# EAGLE schematic avrpwm (EAGLE 6.6.0)
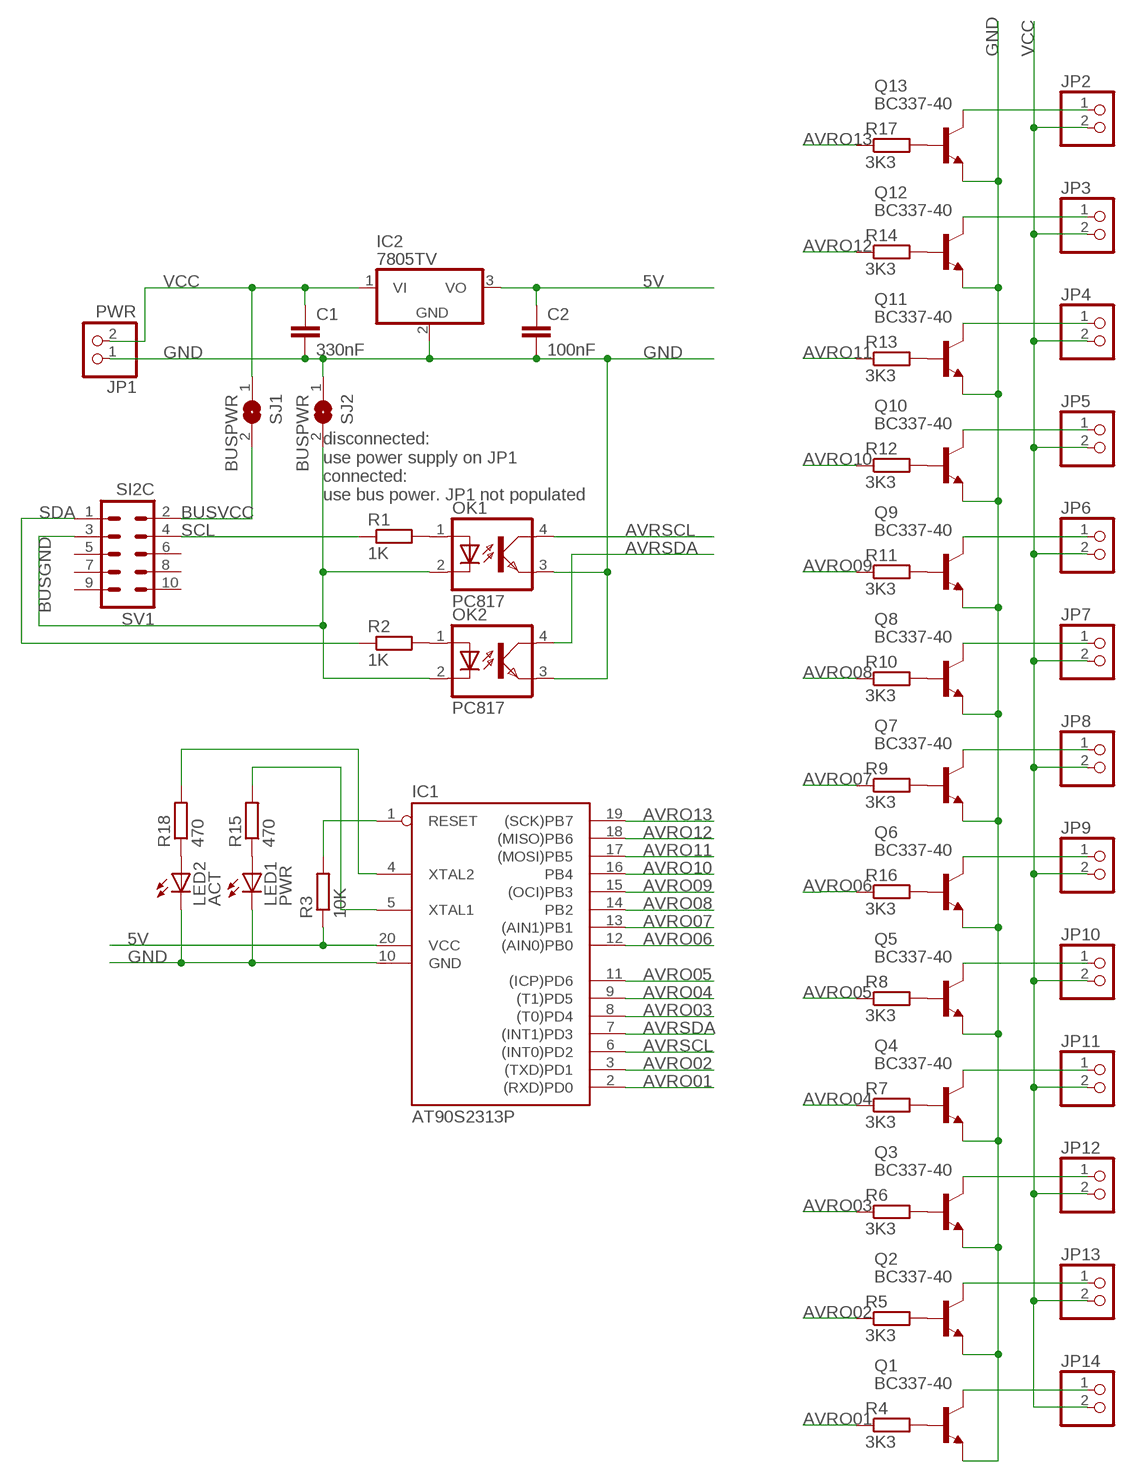
[diagram p0: schematic, sheet 1]

## Parts
C1  330nF  C2,5-3  [C2.5-3]
C2  100nF  C2,5-3  [C2.5-3]
IC1  AT90S2313P  [DIL20]
IC2  7805TV  [TO220V]
JP1  PWR  PINHD-1X2  [1X02]
JP2  PINHD-1X2  [1X02]
JP3  PINHD-1X2  [1X02]
JP4  PINHD-1X2  [1X02]
JP5  PINHD-1X2  [1X02]
JP6  PINHD-1X2  [1X02]
JP7  PINHD-1X2  [1X02]
JP8  PINHD-1X2  [1X02]
JP9  PINHD-1X2  [1X02]
JP10  PINHD-1X2  [1X02]
JP11  PINHD-1X2  [1X02]
JP12  PINHD-1X2  [1X02]
JP13  PINHD-1X2  [1X02]
JP14  PINHD-1X2  [1X02]
LED1  PWR  LED3MM  [LED3MM]
LED2  ACT  LED3MM  [LED3MM]
OK1  PC817  [DIL04]
OK2  PC817  [DIL04]
Q1  BC337-40  [TO92]
Q2  BC337-40  [TO92]
Q3  BC337-40  [TO92]
Q4  BC337-40  [TO92]
Q5  BC337-40  [TO92]
Q6  BC337-40  [TO92]
Q7  BC337-40  [TO92]
Q8  BC337-40  [TO92]
Q9  BC337-40  [TO92]
Q10  BC337-40  [TO92]
Q11  BC337-40  [TO92]
Q12  BC337-40  [TO92]
Q13  BC337-40  [TO92]
R1  1K  R-EU_0207/10  [0207/10]
R2  1K  R-EU_0207/10  [0207/10]
R3  10K  R-EU_0207/10  [0207/10]
R4  3K3  R-EU_0207/10  [0207/10]
R5  3K3  R-EU_0207/10  [0207/10]
R6  3K3  R-EU_0207/10  [0207/10]
R7  3K3  R-EU_0207/10  [0207/10]
R8  3K3  R-EU_0207/10  [0207/10]
R9  3K3  R-EU_0207/10  [0207/10]
R10  3K3  R-EU_0207/10  [0207/10]
R11  3K3  R-EU_0207/10  [0207/10]
R12  3K3  R-EU_0207/10  [0207/10]
R13  3K3  R-EU_0207/10  [0207/10]
R14  3K3  R-EU_0207/10  [0207/10]
R15  470  R-EU_0207/10  [0207/10]
R16  3K3  R-EU_0207/10  [0207/10]
R17  3K3  R-EU_0207/10  [0207/10]
R18  470  R-EU_0207/10  [0207/10]
SJ1  BUSPWR  SJ  [SJ]
SJ2  BUSPWR  SJ  [SJ]
SV1  SI2C  ML10  [ML10]

## Nets
5V: C2.1 IC1.20(VCC) IC2.3(VO) R3.1
AVRO01: IC1.2((RXD)PD0) R4.1
AVRO02: IC1.3((TXD)PD1) R5.1
AVRO03: IC1.8((T0)PD4) R6.1
AVRO04: IC1.9((T1)PD5) R7.1
AVRO05: IC1.11((ICP)PD6) R8.1
AVRO06: IC1.12((AIN0)PB0) R16.1
AVRO07: IC1.13((AIN1)PB1) R9.1
AVRO08: IC1.14(PB2) R10.1
AVRO09: IC1.15((OCI)PB3) R11.1
AVRO10: IC1.16(PB4) R12.1
AVRO11: IC1.17((MOSI)PB5) R13.1
AVRO12: IC1.18((MISO)PB6) R14.1
AVRO13: IC1.19((SCK)PB7) R17.1
AVRSCL: IC1.6((INT0)PD2) OK1.4(COL)
AVRSDA: IC1.7((INT1)PD3) OK2.4(COL)
BUSGND: OK1.2(C) OK2.2(C) SJ2.2 SV1.3
BUSVCC: SJ1.2 SV1.2
GND: C1.2 C2.2 IC1.10(GND) IC2.2(GND) JP1.1 LED1.K(C) LED2.K(C) OK1.3(EMIT) OK2.3(EMIT) Q1.1(E) Q2.1(E) Q3.1(E) Q4.1(E) Q5.1(E) Q6.1(E) Q7.1(E) Q8.1(E) Q9.1(E) Q10.1(E) Q11.1(E) Q12.1(E) Q13.1(E) SJ2.1
N$1: OK1.1(A) R1.2
N$3: IC1.1(RESET) R3.2
N$4: OK2.1(A) R2.2
N$5: Q13.2(B) R17.2
N$6: JP13.1 Q2.3(C)
N$7: JP2.1 Q13.3(C)
N$8: LED2.A R18.1
N$9: Q1.2(B) R4.2
N$10: LED1.A R15.1
N$11: Q2.2(B) R5.2
N$12: Q3.2(B) R6.2
N$13: Q4.2(B) R7.2
N$14: Q5.2(B) R8.2
N$15: Q7.2(B) R9.2
N$16: Q8.2(B) R10.2
N$17: Q9.2(B) R11.2
N$18: Q10.2(B) R12.2
N$19: Q11.2(B) R13.2
N$20: Q12.2(B) R14.2
N$21: IC1.4(XTAL2) R18.2
N$22: Q6.2(B) R16.2
N$23: JP3.1 Q12.3(C)
N$33: IC1.5(XTAL1) R15.2
N$37: JP14.1 Q1.3(C)
N$39: JP12.1 Q3.3(C)
N$40: JP11.1 Q4.3(C)
N$41: JP10.1 Q5.3(C)
N$42: JP9.1 Q6.3(C)
N$43: JP8.1 Q7.3(C)
N$44: JP7.1 Q8.3(C)
N$45: JP6.1 Q9.3(C)
N$46: JP5.1 Q10.3(C)
N$47: JP4.1 Q11.3(C)
SCL: R1.1 SV1.4
SDA: R2.1 SV1.1
VCC: C1.1 IC2.1(VI) JP1.2 JP2.2 JP3.2 JP4.2 JP5.2 JP6.2 JP7.2 JP8.2 JP9.2 JP10.2 JP11.2 JP12.2 JP13.2 JP14.2 SJ1.1
Unconnected: SV1.5 SV1.6 SV1.7 SV1.8 SV1.9 SV1.10

## Notes on the sheet
- disconnected:
  use power supply on JP1
  connected:
  use bus power. JP1 not populated

## Library data of the parts
C1 C2 = capacitor-wima:C: CAPACITOR naming: grid - package width
IC1 = atmel:AT90S2313: MICROCONTROLLER 2 Kbytes FLASH 128 bytes SRAM 128 bytes EEPROM UART; OC_FARNELL: unknown; OC_NEWARK: unknown
IC2 = linear:78*: Positive VOLTAGE REGULATOR Source: http://cache.national.com/ds/LM/LM78L05.pdf http://www.fairchildsemi.com/ds/LM/LM7805.pdf
JP1-JP14 = pinhead:PINHD-1X2: PIN HEADER
LED1 LED2 = led:LED: LED OSRAM: - CHIPLED LG R971, LG N971, LY N971, LG Q971, LY Q971, LO R971, LY R971 LH N974, LH R974 LS Q976, LO Q976, LY Q976 LO Q996 - Hyper CHIPLED LW Q18S LB Q993, LB Q99A, LB R99A - SideLED LS A670, LO A670, LY A670, LG A670, LP A670 LB A673, LV A673, LT A673, LW A673 LH A674 LY A675 LS A676, LA A676, LO A676, LY A676, LW A676 LS A679, LY A679, LG A679 - Hyper Micro SIDELED® LS Y876, LA Y876, LO Y876, LY Y876 LT Y87S - SmartLED LW L88C, LW L88S LB L89C, LB L89S, LG L890 LS L89K, LO L89K, LY L89K LS L896, LA L896, LO L896, LY L896 - TOPLED LS T670, LO T670, LY T670, LG T670, LP T670 LSG T670, LSP T670, LSY T670, LOP T670, LYG T670 LG T671, LOG T671, LSG T671 LB T673, LV T673, LT T673, LW T673 LH T674 LS T676, LA T676, LO T676, LY T676, LB T676, LH T676, LSB T676, LW T676 LB T67C, LV T67C, LT T67C, LS T67K, LO T67K, LY T67K, LW E67C LS E67B, LA E67B, LO E67B, LY E67B, LB E67C, LV E67C, LT E67C LW T67C LS T679, LY T679, LG T679 LS T770, LO T770, LY T770, LG T770, LP T770 LB T773, LV T773, LT T773, LW T773 LH T774 LS E675, LA E675, LY E675, LS T675 LS T776, LA T776, LO T776, LY T776, LB T776 LHGB T686 LT T68C, LB T68C - Hyper Mini TOPLED® LB M676 - Mini TOPLED Santana® LG M470 LS M47K, LO M47K, LY M47K Source: http://www.osram.convergy.de LUXEON: - LUMILED® LXK2-PW12-R00, LXK2-PW12-S00, LXK2-PW14-U00, LXK2-PW14-V00 LXK2-PM12-R00, LXK2-PM12-S00, LXK2-PM14-U00 LXK2-PE12-Q00, LXK2-PE12-R00, LXK2-PE12-S00, LXK2-PE14-T00, LXK2-PE14-U00 LXK2-PB12-K00, LXK2-PB12-L00, LXK2-PB12-M00, LXK2-PB14-N00, LXK2-PB14-P00, LXK2-PB14-Q00 LXK2-PR12-L00, LXK2-PR12-M00, LXK2-PR14-Q00, LXK2-PR14-R00 LXK2-PD12-Q00, LXK2-PD12-R00, LXK2-PD12-S00 LXK2-PH12-R00, LXK2-PH12-S00 LXK2-PL12-P00, LXK2-PL12-Q00, LXK2-PL12-R00 Source: www.luxeon.com KINGBRIGHT: KA-3528ASYC Source: www.kingbright.com
OK1 OK2 = optocoupler:PC817: SHARP OPTO COUPLER; MPN: PC817X4J000F; OC_FARNELL: 9707727; OC_NEWARK: 97K7059
Q1-Q13 = transistor-npn:BC337*: NPN Transistor
R1-R18 = resistor:R-EU_: RESISTOR, European symbol
SJ1 SJ2 = jumper:SJ: SMD solder JUMPER
SV1 = con-harting-ml:ML10: HARTING; OC_FARNELL: unknown; OC_NEWARK: unknown